# Altium schematic sheet Iso_Regulators.SchDoc
size A4; SheetNumber: 5; SheetTotal: 5
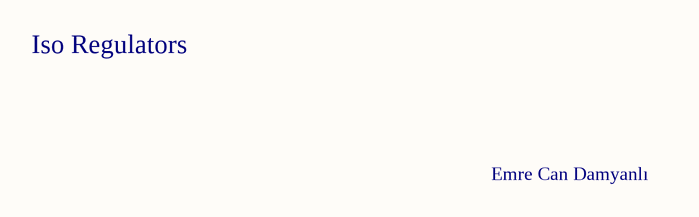
[diagram p0: Iso_Regulators.SchDoc]

## Notes on the sheet
- Iso Regulators
- Emre Can Damyanlı